# EasyEDA Pro project ProPrj_飞行器设计之5.8Ghz图传_2025-12-20.epro, schematic 5.8Ghz图传_4
Create Date: 2022-09-13; Page Name: P1; Project Name: 飞行器设计之5.8Ghz图传; Schematic Name: 5.8Ghz图传_2; Update Date: 2022-11-13; Company: CYF
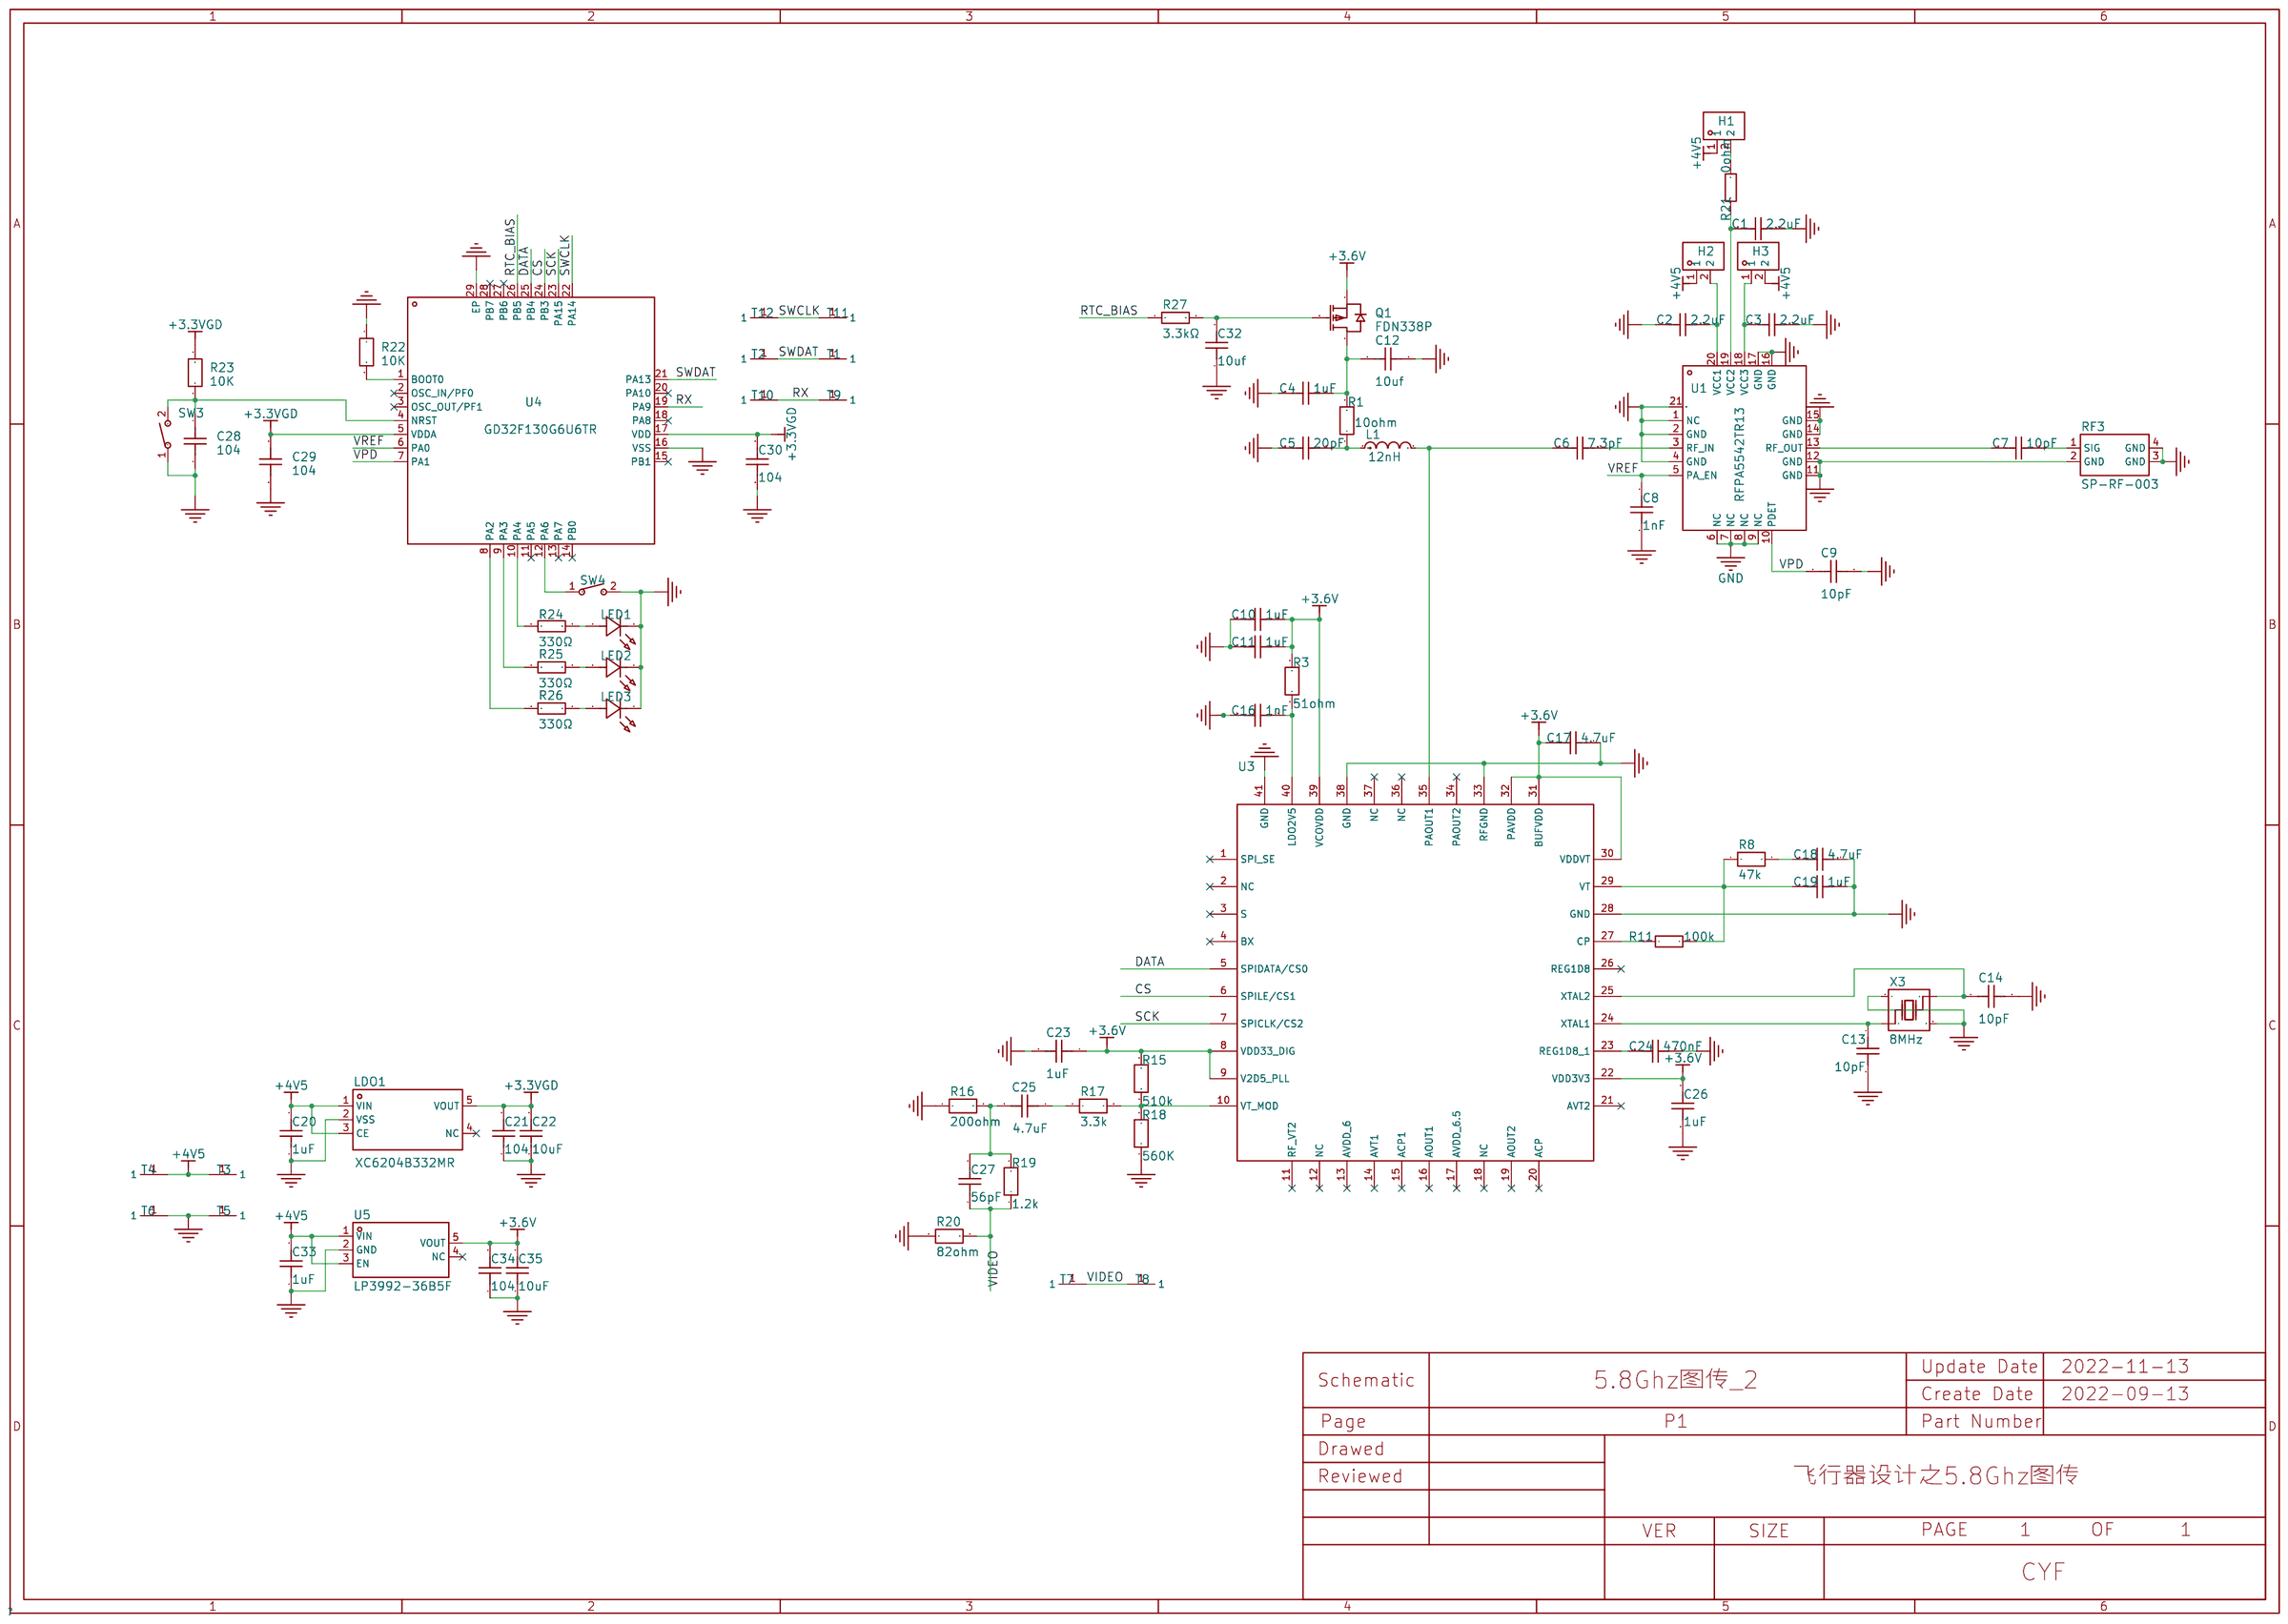
[diagram p3: schematic sheet]

## Parts
C1  2.2uF  [C0402]
C2  2.2uF  [C0402]
C3  2.2uF  [C0402]
C4  1uF  [C0402]
C5  20pF  [C0402-0.5]
C6  7.3pF  [C0201]
C7  10pF  [C0201]
C8  1nF  [C0402]
C9  10pF  [C0402]
C10  1uF  [C0402]
C11  1uF  [C0402]
C12  10uf  [C0402]
C13  10pF  [C0402]
C14  10pF  [C0402]
C16  1nF  [C0402]
C17  4.7uF  [C0402]
C18  4.7uF  [C0402]
C19  1uF  [C0402]
C20  1uF  [C0402]
C21  104  [C0402]
C22  10uF  [C0402]
C23  1uF  [C0402]
C24  470nF  [C0402]
C25  4.7uF  [C0402]
C26  1uF  [C0402]
C27  56pF  [C0402]
C28  104  [C0402]
C29  104  [C0402]
C30  104  [C0402]
C32  10uf  [C0402]
C33  1uF  [C0402]
C34  104  [C0402]
C35  10uF  [C0402]
H1  KH-1.27PH180-1X2P-L7.2  [HDR-TH_2P-P1.27-V-M]
H2  KH-1.27PH180-1X2P-L7.2  [HDR-TH_2P-P1.27-V-M]
H3  KH-1.27PH180-1X2P-L7.2  [HDR-TH_2P-P1.27-V-M]
L1  12nH  [L0201]
LDO1  XC6204B332MR  [SOT-23-5_L3.0-W1.7-P0.95-LS2.8-BR]
LED1  XL-1608UBC-04  [LED0603-RD_BLUE]
LED2  XL-1608UBC-04  [LED0603-RD_BLUE]
LED3  XL-1608UBC-04  [LED0603-RD_BLUE]
Q1  FDN338P  [SOT-23-3_L2.9-W1.3-P1.90-LS2.4-BR]
R1  10ohm  [R0402-0.5]
R3  51ohm  [R0402]
R8  47k  [R0402]
R11  100k  [R0402]
R15  510k  [R0402]
R16  200ohm  [R0402]
R17  3.3k  [R0402]
R18  560K  [R0402]
R19  1.2k  [R0402]
R20  82ohm  [R0402]
R21  0ohm  [R0402]
R22  10K  [R0402]
R23  10K  [R0402]
R24  330Ω  [R0402]
R25  330Ω  [R0402]
R26  330Ω  [R0402]
R27  3.3kΩ  [R0402]
RF3  SP-RF-003  [IPEX-SMD_SP-RF-003]
SW3  TS342A2P-WZ  [SW-SMD_L4.0-W2.9-LS5.0]
SW4  TS342A2P-WZ  [SW-SMD_L4.0-W2.9-LS5.0]
T1  -  [TEST_PAD]
T2  -  [TEST_PAD]
T3  -  [TEST_PAD]
T4  -  [TEST_PAD]
T5  -  [TEST_PAD]
T6  -  [TEST_PAD]
T7  -  [TEST_PAD]
T8  -  [TEST_PAD]
T9  -  [TEST_PAD]
T10  -  [TEST_PAD]
T11  -  [TEST_PAD]
T12  -  [TEST_PAD]
U1  RFPA5542TR13  [QFN-20_L4.0-W4.0]
U3  -  [QFN-40-1]
U4  GD32F130G6U6TR  [QFN-28_L4.0-W4.0-P0.40-BL-EP]
U5  LP3992-36B5F  [SOT-23-5_L3.0-W1.7-P0.95-LS2.8-BL]
X3  8MHz  [OSC-SMD_4P-L3.2-W2.5-BL]

## Library data of the parts
C1-C3 = C1005X7S1A225KT000E: 温度系数:X7S;容值:2.2uF;电容体长:-;精度:±10%;电容体宽:-;电容体厚度:-;额定电压:10V;; LCSC Part Name: 2.2uF(225) ±10% 10V; Supplier Part: C445740; Manufacturer: TDK; Supplier Footprint: 0402; JLCPCB Part Class: Extended Part; Datasheet: https://atta.szlcsc.com/upload/public/pdf/source/20191108/C445740_EC5E1EA4727CB2A1B59729B04E8D3664.pdf; Supplier: LCSC; Temperature Coefficient: X7S; Tolerance: ±10%; Voltage Rated: 10V
C4 C10 C11 C19 C20 C23 C26 C33 = C1005X5R1A105KTJ00F: 容值:1uF;精度:±10%;额定电压:10V;材质(温度系数):X5R;; LCSC Part Name: 1uF ±10% 10V; Supplier Part: C694162; Manufacturer: TDK; Supplier Footprint: 0402; JLCPCB Part Class: Extended Part; Datasheet: https://atta.szlcsc.com/upload/public/pdf/source/20191008/C432930_1569A900251E35B50161EFC1E9A1C511.pdf; Supplier: LCSC; Tolerance: ±10%; Voltage Rated: 10V; Temperature Coefficient: X5R
C5 = CC0201GRNPO9BN200: 温度系数:NP0;精度:±2%;电容体长:-;容值:20pF;电容体宽:-;电容体厚度:-;额定电压:50V;; Supplier: LCSC; Supplier Part: C541253; Supplier Footprint: 0201; JLCPCB Part Class: Extended Part; LCSC Part Name: 20pF ±2% 50V; Tolerance: ±2%; Datasheet: https://atta.szlcsc.com/upload/public/pdf/source/20200615/C541253_9EA6E2C9F1C0B6F889020B56608FD726.pdf; Manufacturer: YAGEO(国巨); Temperature Coefficient: NP0; Voltage Rated: 50V
C6 C7 = GJM0335C1E100FB01D: 容值:10pF;精度:±1%;额定电压:25V;材质(温度系数):C0G;; LCSC Part Name: 10pF ±1% 25V; Supplier Part: C2891570; Manufacturer: muRata(村田); Supplier Footprint: 0201; JLCPCB Part Class: Extended Part; Datasheet: https://atta.szlcsc.com/upload/public/pdf/source/20210910/F9DCB1D557D9855623001B89175B6F09.pdf; Supplier: LCSC; Tolerance: ±1%; Voltage Rated: 25V; Temperature Coefficient: C0G
C8 C16 = C0402C102K5RACAUTO: 温度系数:X7R;容值:1nF;精度:±10%;额定电压:50V;; LCSC Part Name: 1nF(102) ±10% 50V; Supplier Part: C141053; Manufacturer: KEMET(基美); Supplier Footprint: 0402; JLCPCB Part Class: Extended Part; Datasheet: https://atta.szlcsc.com/upload/public/pdf/source/20180326/C141053_0F41C27EF3713F9AA904312754A59387.pdf; Supplier: LCSC; Temperature Coefficient: X7R; Tolerance: ±10%; Voltage Rated: 50V
C9 C13 C14 = GRM1555C1H100FA01D: 容值:10pF;精度:±1%;额定电压:50V;温度系数:C0G;; LCSC Part Name: 10pF ±1% 50V; Supplier Part: C161520; Manufacturer: muRata(村田); Supplier Footprint: 0402; JLCPCB Part Class: Extended Part; Datasheet: https://atta.szlcsc.com/upload/public/pdf/source/20180403/C161520_9A02104BF56AEB009FBC9B33A38C7A93.pdf; Supplier: LCSC; Tolerance: ±1%; Voltage Rated: 50V; Temperature Coefficient: C0G
C12 C32 = 10uf
C17 C18 C25 = C1005X5R1A475KTJ00E: 容值:4.7uF;精度:±10%;额定电压:10V;材质(温度系数):X5R;; LCSC Part Name: 4.7uF ±10% 10V; Supplier Part: C342983; Manufacturer: TDK; Supplier Footprint: 0402; JLCPCB Part Class: Extended Part; Datasheet: https://atta.szlcsc.com/upload/public/pdf/source/20190225/C342983_2978EAEA2EB9BD3D70BC8CD3A599A0C7.pdf; Supplier: LCSC; Tolerance: ±10%; Voltage Rated: 10V; Temperature Coefficient: X5R
C21 C28-C30 C34 = CAP_0402: 容值:100nF;精度:±10%;额定电压:16V;温度系数:X7R;; Supplier Part: C1525; Supplier Footprint: 0402
C22 C35 = GRM155R61A106ME44D: 容值:10uF;精度:±20%;额定电压:10V;材质(温度系数):X5R;; LCSC Part Name: 10uF ±20% 10V; Supplier Part: C77000; Manufacturer: muRata(村田); Supplier Footprint: 0402; JLCPCB Part Class: Extended Part; Datasheet: https://atta.szlcsc.com/upload/public/pdf/source/20180530/C77000_4866797CFE3A842CD03C597EBD6AE6CD.pdf; Supplier: LCSC; Tolerance: ±20%; Voltage Rated: 10V; Temperature Coefficient: X5R
C24 = GRM155C81C474KE01D: 容值:470nF;精度:±10%;额定电压:16V;材质(温度系数):X6S;; LCSC Part Name: 470nF ±10% 16V; Supplier Part: C162162; Manufacturer: muRata(村田); Supplier Footprint: 0402; JLCPCB Part Class: Extended Part; Datasheet: https://atta.szlcsc.com/upload/public/pdf/source/20191226/C162162_83BD8EAA09A667F500D501D4FA61E7F9.pdf; Supplier: LCSC; Tolerance: ±10%; Voltage Rated: 16V; Temperature Coefficient: X6S
C27 = CL05C560JB51PNC: 容值:56pF;精度:±5%;额定电压:50V;材质(温度系数):C0G;; LCSC Part Name: 56pF ±5% 50V; Supplier Part: C472455; Manufacturer: SAMSUNG(三星); Supplier Footprint: 0402; JLCPCB Part Class: Extended Part; Datasheet: https://atta.szlcsc.com/upload/public/pdf/source/20191223/C472455_77C29F1AA91604A0158436A00A53DD86.pdf; Supplier: LCSC; Tolerance: ±5%; Voltage Rated: 50V; Temperature Coefficient: C0G
H1-H3 = KH-1.27PH180-1X2P-L7.2: 间距:1.27mm;总PIN位数:2;排数:1;插针结构:1x2P;行距:-;安装类型:直插;圆针/方针:方针;额定电流:1A;额定电压:-;配合针长度:3.9mm;塑高:1mm;端接针长度:2.3mm;工作温度范围:-40~+105;颜色:-;; LCSC Part Name: 1.27mm 1x2P 直插 方针; Supplier Part: C2938400; Manufacturer: kinghelm(金航标); Supplier Footprint: 插件,P=1.27mm; JLCPCB Part Class: Extended Part; Datasheet: https://atta.szlcsc.com/upload/public/pdf/source/20211228/57F3739EB46B12C24FE81C3BF1D5EF55.pdf; Supplier: LCSC; Pitch: 1.27mm; Number of Pins: 2; Number of Rows: 1; Pin Structure: 1x2P; Mounting Type: 直插; Circluar Pins/Square Pins: 方针; Current Rating (Max): 1A; Length of Mating Pin: 3.9mm; Insulation Height: 1mm; Length of End Connection Pin: 2.3mm; Operating Temperature Range: -40~+105
L1 = LQP03TN3N6B02D: 电感值:3.6nH;精度:±0.1nH;额定电流:-;饱和电流(Isat):-;直流电阻(DCR):300mΩ;; Supplier: LCSC; Supplier Part: C162616; Supplier Footprint: 0201; JLCPCB Part Class: Extended Part; LCSC Part Name: 3.6nH ±0.1nH 300mΩ; Tolerance: ±0.1nH; Datasheet: https://atta.szlcsc.com/upload/public/pdf/source/20180814/C162616_AB57828BE0B922B42F389197093E93C5.pdf; Manufacturer: muRata(村田); DC Resistance (DCR): 300mΩ; Frequency - Self Resonant: 6GHz; Q @ Freq: 14@500MHz
LDO1 = XC6204B332MR: 输出类型:固定;输出极性:正;输出通道数:1;最大输入电压:10V;输出电压:3.3V;压差:330mV@(100mA);输出电流:150mA;电源纹波抑制比(PRSS):70dB@(10kHz);; LCSC Part Name: Vin=10V Vout=3.3V 150mA 70dB@(10kHz); Supplier Part: C80697; Manufacturer: TOREX(特瑞仕); Supplier Footprint: SOT-23-5; JLCPCB Part Class: Extended Part; Datasheet: https://atta.szlcsc.com/upload/public/pdf/source/20160903/1472896601676.pdf; Supplier: LCSC; Output Type: 固定; Output Polarity: 正; Number of Outputs: 1; Maximum Input Voltage: 10V; Output Voltage: 3.3V; Dropout Voltage: 330mV@(100mA); Output Current: 150mA; Power Supply Rejection Ratio (PRSS): 70dB@(10kHz)
LED1-LED3 = XL-1608UBC-04: 发光颜色:蓝灯;透镜颜色:无色透明;主波长:460nm~469nm;峰值波长:475nm;色温:-;光通量(25时):-;测试电流:25mA;正向电压(VF):2.9V;发光强度:60mcd;功率:80mW;发光角度:120°;安装方式:正贴;工作温度:-30~+85;; LCSC Part Name: 蓝灯 正贴; Supplier Part: C965807; Manufacturer: XINGLIGHT(成兴光); Supplier Footprint: 0603; JLCPCB Part Class: Extended Part; Datasheet: https://atta.szlcsc.com/upload/public/pdf/source/20201230/C965807_0B1866580FA037C0283EE42D08A2BF0F.pdf; Supplier: LCSC; Emitted Color: 蓝灯; Lens Color: 无色透明; Dominant Wavelength: 460nm~469nm; Peak Wavelength: 475nm; Forward Current: 25mA; Forward Voltage (VF): 2.9V; Luminous Intensity: 60mcd; Power Dissipation: 80mW; Viewing Angle: 120°; Mounting Sytle: 正贴; Operating Temperature: -30~+85
Q1 = FDN338P_C518789: 漏源电压（Vdss）:20V;连续漏极电流（Id）（25°C 时）:3A;栅源极阈值电压:1V @ 250uA;漏源导通电阻:100mΩ @ 3A,4.5V;最大功率耗散（Ta=25°C）:1W;类型:P沟道;; Supplier Part: C518789; Manufacturer: HUASHUO(华朔); Supplier Footprint: SOT-23-3; JLCPCB Part Class: Extended Part; Datasheet: https://atta.szlcsc.com/upload/public/pdf/source/20200421/C518789_D5DDD5CD134B3D6DE53D66BD1C002E54.pdf; Supplier: LCSC
R1 = ERJ1GNF10R0C: 阻值:10Ω;精度:±1%;功率:50mW;; Power(Watts): 50mW; Supplier: LCSC; Supplier Part: C717005; Supplier Footprint: 0201; JLCPCB Part Class: Extended Part; LCSC Part Name: 10Ω ±1% 50mW; Tolerance: ±1%; Datasheet: https://atta.szlcsc.com/upload/public/pdf/source/20201126/C717005_1D9EDC7DAFC9209451DC5B78B9B54637.pdf; Manufacturer: PANASONIC(松下)
R3 = ERJ2RKF51R0X: 阻值:51Ω;精度:±1%;功率:100mW;温度系数:±100ppm/;最大工作电压:100V;工作温度范围:-55~+155;; LCSC Part Name: 51Ω ±1% 100mW; Supplier Part: C413057; Manufacturer: PANASONIC(松下); Supplier Footprint: 0402; JLCPCB Part Class: Extended Part; Datasheet: https://atta.szlcsc.com/upload/public/pdf/source/20190820/C413057_3C5D27E6BC9C8BDD75D5FF1586C00B52.pdf; Supplier: LCSC; Tolerance: ±1%; Power(Watts): 100mW; Temperature Coefficient: ±100ppm/; Overload Voltage (Max): 100V; Operating Temperature Range: -55~+155
R8 = ERJ2RKF4702X: LCSC Part Name: 47KΩ(4702) ±1%; Supplier Part: C413103; Manufacturer: PANASONIC(松下); Supplier Footprint: 0402; JLCPCB Part Class: Extended Part; Datasheet: https://atta.szlcsc.com/upload/public/pdf/source/20190820/C413103_733665ABBD1E1D82C449C55FBA055B2C.pdf; Supplier: LCSC
R11 = ERJ2RKF1003X: 阻值:100kΩ;精度:±1%;功率:100mW;温度系数:±100ppm/;最大工作电压:-;工作温度范围:-55~+155;; LCSC Part Name: 100kΩ ±1% 100mW 停产; Supplier Part: C192169; Manufacturer: PANASONIC(松下); Supplier Footprint: 0402; JLCPCB Part Class: Extended Part; Datasheet: https://atta.szlcsc.com/upload/public/pdf/source/20180502/C192169_E542DDD390EC9A5A5C2F0F641FE5D413.pdf; Supplier: LCSC; Tolerance: ±1%; Power(Watts): 100mW; Temperature Coefficient: ±100ppm/; Operating Temperature Range: -55~+155
R15 = ERJ2RKF5103X: 阻值:510kΩ;精度:±1%;功率:100mW;温度系数:±100ppm/;最大工作电压:-;工作温度范围:-55~+125;; LCSC Part Name: 510kΩ ±1% 100mW; Supplier Part: C413120; Manufacturer: PANASONIC(松下); Supplier Footprint: 0402; JLCPCB Part Class: Extended Part; Datasheet: https://atta.szlcsc.com/upload/public/pdf/source/20190820/C413120_F6905343057AF4F4B1F95E8F28A368B4.pdf; Supplier: LCSC; Tolerance: ±1%; Power(Watts): 100mW; Temperature Coefficient: ±100ppm/; Operating Temperature Range: -55~+125
R16 = CRCW0402200RFKED: 电阻类型:厚膜电阻;阻值:200Ω;精度:±1%;功率:63mW;温度系数:±100ppm/K;最大工作电压:50V;工作温度范围:-55~+155;; LCSC Part Name: 200Ω ±1% 63mW; Supplier Part: C482094; Manufacturer: VISHAY(威世); Supplier Footprint: 0402; JLCPCB Part Class: Extended Part; Datasheet: https://atta.szlcsc.com/upload/public/pdf/source/20200618/C481956_E25174B008CE8C884BEDD7D4D15E674F.pdf; Supplier: LCSC; Type: 厚膜电阻; Tolerance: ±1%; Power(Watts): 63mW; Temperature Coefficient: ±100ppm/K; Overload Voltage (Max): 50V; Operating Temperature Range: -55~+155
R17 = CRCW04023K30FKED: 最大工作电压:75V;工作温度范围:-55~+155;电阻长:-;精度:±1 %;功率:63mW;电阻直径:-;电阻高:-;电阻宽:-;温度系数:±100ppm/K;阻值:3.3kΩ;电阻类型:-;; LCSC Part Name: 3.3kΩ ±1%; Supplier Part: C482167; Manufacturer: VISHAY(威世); Supplier Footprint: 0402; JLCPCB Part Class: Extended Part; Datasheet: https://atta.szlcsc.com/upload/public/pdf/source/20200618/C481956_E25174B008CE8C884BEDD7D4D15E674F.pdf; Supplier: LCSC; Overload Voltage (Max): 75V; Operating Temperature Range: -55~+155; Tolerance: ±1 %; Power(Watts): 63mW; Temperature Coefficient: ±100ppm/K
R18 = ERJ2RKF5603X: Supplier: LCSC; Supplier Part: C413121; Supplier Footprint: 0402; JLCPCB Part Class: Extended Part; LCSC Part Name: 560KΩ(5603) ±1%; Datasheet: https://atta.szlcsc.com/upload/public/pdf/source/20190820/C413121_708116196E1F90A27E9EFDB3423FC67B.pdf; Manufacturer: PANASONIC(松下)
R19 = CQ02WGF1201TCE: 阻值:1.2kΩ;精度:±1%;功率:62.5mW;温度系数:±100ppm/;; LCSC Part Name: 1.2kΩ ±1% 62.5mW; Supplier Part: C966872; Manufacturer: UNI-ROYAL(厚声); Supplier Footprint: 0402; JLCPCB Part Class: Extended Part; Datasheet: https://atta.szlcsc.com/upload/public/pdf/source/20191220/C473620_6C11B82F3C06B184C34B0BC4B16C3771.pdf; Supplier: LCSC; Tolerance: ±1%; Power(Watts): 62.5mW; Temperature Coefficient: ±100ppm/
R20 = ERJ2RKF82R0X: 阻值:82Ω;精度:±1%;功率:100mW;温度系数:±100ppm/;最大工作电压:-;工作温度范围:-55~+125;; LCSC Part Name: 82Ω ±1%; Supplier Part: C413062; Manufacturer: PANASONIC(松下); Supplier Footprint: 0402; JLCPCB Part Class: Extended Part; Datasheet: https://atta.szlcsc.com/upload/public/pdf/source/20190820/C413062_AFB0A641FB0D2B21716E04467C9EB1B9.pdf; Supplier: LCSC; Tolerance: ±1%; Power(Watts): 100mW; Temperature Coefficient: ±100ppm/; Operating Temperature Range: -55~+125
R21 = RC0402FR-070RL: 温度系数:-;功率:1/16W;精度:±1%;阻值:0Ω;最大工作电压:50V;工作温度范围:-55~+155;; LCSC Part Name: 0Ω ±1%; Supplier Part: C106231; Manufacturer: YAGEO(国巨); Supplier Footprint: 0402; JLCPCB Part Class: Extended Part; Datasheet: https://atta.szlcsc.com/upload/public/pdf/source/20170518/1495085712260.pdf; Supplier: LCSC; Power(Watts): 1/16W; Tolerance: ±1%; Overload Voltage (Max): 50V; Operating Temperature Range: -55~+155
R22 R23 = FRC0402F1002TS: LCSC Part Name: 10KΩ ±1%; Supplier Part: C2906861; Manufacturer: FOJAN(富捷); Supplier Footprint: 0402; JLCPCB Part Class: Extended Part; Datasheet: https://atta.szlcsc.com/upload/public/pdf/source/20211102/08480A48F159CF742D398A1E4DC90941.pdf; Supplier: LCSC
R24-R26 = CR0402FF3300G: 电阻类型:厚膜电阻;阻值:330Ω;精度:±1%;功率:62.5mW;温度系数:±200ppm/;最大工作电压:50V;工作温度范围:-55~+125;; LCSC Part Name: 330Ω ±1% 62.5mW; Supplier Part: C100375; Manufacturer: LIZ(丽智电子); Supplier Footprint: 0402; JLCPCB Part Class: Extended Part; Datasheet: https://atta.szlcsc.com/upload/public/pdf/source/20170408/1491621431662.pdf; Supplier: LCSC; Type: 厚膜电阻; Tolerance: ±1%; Power(Watts): 62.5mW; Temperature Coefficient: ±200ppm/; Overload Voltage (Max): 50V; Operating Temperature Range: -55~+125
R27 = 0402WGF3301TCE: 电阻类型:厚膜电阻;阻值:3.3kΩ;精度:±1%;功率:62.5mW;温度系数:±100ppm/;最大工作电压:50V;工作温度范围:-55~+155;; LCSC Part Name: 3.3kΩ ±1% 62.5mW; Supplier Part: C25890; Manufacturer: UNI-ROYAL(厚声); Supplier Footprint: 0402; JLCPCB Part Class: Basic Part; Datasheet: https://atta.szlcsc.com/upload/public/pdf/source/20200306/C422600_1E6D84923E4A46A82E41ADD87F860B5C.pdf; Supplier: LCSC; Type: 厚膜电阻; Tolerance: ±1%; Power(Watts): 62.5mW; Temperature Coefficient: ±100ppm/; Overload Voltage (Max): 50V; Operating Temperature Range: -55~+155
RF3 = SP-RF-003: 连接器类型:板端;射频系列:IPEX;接口类型:内针;端口数量:1;阻抗:-;频率-最大值:-;样式:-;接口直径:1.4mm;接口长度/高度:0.55mm;工作温度范围:-;; LCSC Part Name: IPEX 内针 3代; Supplier Part: C920233; Manufacturer: XUNPU(讯普); Supplier Footprint: SMD; JLCPCB Part Class: Extended Part; Datasheet: https://atta.szlcsc.com/upload/public/pdf/source/20201225/C920233_44338BF733EA99A9F616220D1D8A6F25.pdf; Supplier: LCSC; Connector Type: 板端; RF Series: IPEX; Interface Type: 内针; Number of Ports: 1; Interface Diameter: 1.4mm; Interface Length/Height: 0.55mm
SW3 SW4 = TS342A2P-WZ: LCSC Part Name: 轻触开关 3*4*2 两脚小龟不带柱 250gf 黑色塑胶按钮; Supplier Part: C557591; Manufacturer: SHOU HAN(首韩); Supplier Footprint: SMD; JLCPCB Part Class: Extended Part; Datasheet: https://atta.szlcsc.com/upload/public/pdf/source/20200519/C557591_B3A5A21584733303F06306F18577DA8B.pdf; Supplier: LCSC
T1-T12 = TEST_PAD
U1 = RFPA5542TR13: 频率范围:-;IP1dB:-;增益:-;噪声系数:-;; Supplier Part: C469030; Manufacturer: Qorvo; Supplier Footprint: QFN_4X4mm; JLCPCB Part Class: Extended Part; Datasheet: https://atta.szlcsc.com/upload/public/pdf/source/20191212/C469030_D6F7318F7C7F55904A4BD83092D9C25F.pdf; Supplier: LCSC
U3 = RTC
U4 = GD32F130G6U6TR: CPU内核:ARM Cortex-M3;CPU最大主频:72MHz;工作电压范围:2.6V~3.6V;内部振荡器:有;外部时钟频率范围:4MHz~32MHz;程序 FLASH容量:32KB;RAM总容量:4KB;EEPROM/数据 FLASH容量:-;GPIO端口数量:23;ADC(单元数/通道数/位数):1@x10ch/12bit;DAC(单元数/通道数/位数):-;(E)PWM(单元数/通道数/位数):1@x16bit;8位Timer数量:-;16位Timer数量:4;32位Timer数量:1;内部比; Supplier Part: C94320; Manufacturer: GigaDevice(兆易创新); Supplier Footprint: QFN-28; JLCPCB Part Class: Extended Part; Datasheet: https://atta.szlcsc.com/upload/public/pdf/source/20180508/C94320_1F50BC9AA004C7DC56FBFADEBEB35FD5.pdf; Supplier: LCSC; CPU Core: ARM Cortex-M3; Maximum Frequency: 72MHz; Supply Voltage Range: 2.6V~3.6V; Internal Oscillator: 有; External Clock Frequency Rang: 4MHz~32MHz; Program FLASH Size: 32KB; RAM Size: 4KB; GPIO Ports Number: 23; ADC (Units/Channels/bits): 1@x10ch/12bit; (E)PWM (Units/Channels/bits): 1@x16bit; 16Bit Timer Number: 4; 32Bit Timer Number: 1; U(S)ART Number: 2; I2C Number: 1; (Q)SPI Number: 1; Peripherals / Functions / Protocol Stacks: 片载温度传感器；DMA；看门狗；LIN总线协议；PWM；除法器；IrDA；乘法器；RTC实时时钟; Operating Temperature Range: -40~+85
U5 = LP3992-36B5F: 输出类型:固定;输出极性:正;输出通道数:1;最大输入电压:6.5V;输出电压:3.6V;压差:-;输出电流:300mA;电源纹波抑制比(PSRR):76dB@(1kHz);; LCSC Part Name: Vin=6.5V Vout=3.6V 300mA 76dB@(1kHz); Supplier Part: C387682; Manufacturer: LOWPOWER(微源半导体); Supplier Footprint: SOT-23-5; JLCPCB Part Class: Extended Part; Datasheet: https://atta.szlcsc.com/upload/public/pdf/source/20190410/C387682_B8B7B9A3936FEC4BA95F8612E4A51AA8.pdf; Supplier: LCSC; Output Type: 固定; Output Polarity: 正; Number of Outputs: 1; Maximum Input Voltage: 6.5V; Output Voltage: 3.6V; Output Current: 300mA; Power Supply Rejection Ratio (PSRR): 76dB@(1kHz)
X3 = TAXM8M4RDBCCT2T: 晶振类型:SMD 谐振器;频率:8MHz;频率公差:±10ppm;频率稳定度:±15ppm;负载电容:10pF;等效串联电阻(ESR):250Ω;工作温度:-;; LCSC Part Name: 8MHz ±10ppm 10pF; Supplier Part: C400090; Manufacturer: TAE(雅晶鑫); Supplier Footprint: SMD3225-4P; JLCPCB Part Class: Extended Part; Datasheet: https://atta.szlcsc.com/upload/public/pdf/source/20190626/C400090_CF95B89E745AFE4EF2E392EF8AC009D6.pdf; Supplier: LCSC; Crystal Type: SMD 谐振器; Frequency Tolerance: ±10ppm; Frequency Stability: ±15ppm; Load Capacitance: 10pF; Equivalent Series Resistance (ESR): 250Ω

## Nets
+3.3VGD: C21.2 C22.2 C29.1 C30.1 LDO1.5(VOUT) R23.1 U4.5(VDDA) U4.17(VDD)
+3.6V: C10.2 C11.2 C17.2 C23.1 C26.1 C34.2 C35.2 Q1.2(S) R3.2 R15.2 U3.8(VDD33_DIG) U3.9(V2D5_PLL) U3.22(VDD3V3) U3.30(VDDVT) U3.31(BUFVDD) U3.32(PAVDD) U3.39(VCOVDD) U5.5(VOUT)
+4V5: C20.2 C33.2 H1.1 H2.1 H3.2 LDO1.1(VIN) LDO1.3(CE) T3.1 T4.1 U5.1(VIN) U5.3(EN)
GND: C1.2 C2.1 C3.2 C4.1 C5.1 C8.2 C9.1 C10.1 C11.1 C12.1 C13.2 C14.2 C16.2 C17.1 C18.1 C19.1 C20.1 C21.1 C22.1 C23.2 C24.2 C26.2 C28.2 C29.2 C30.2 C32.1 C33.1 C34.1 C35.1 LDO1.2(VSS) LED1.1(K) LED2.1(K) LED3.1(K) R16.1 R18.1 R20.1 R22.1 RF3.2(GND) RF3.3(GND) RF3.4(GND) SW3.1 SW4.2 T5.1 T6.1 U1.1(NC) U1.2(GND) U1.4(GND) U1.6(NC) U1.7(NC) U1.8(NC) U1.9(NC) U1.11(GND) U1.12(GND) U1.14(GND) U1.15(GND) U1.16(GND) U1.17(GND) U1.21(PAD) U3.28(GND) U3.33(RFGND) U3.38(GND) U3.41(GND) U4.16(VSS) U4.29(EP) U5.2(GND) X3.2 X3.4
CS: U3.6(SPILE/CS1) U4.24(PB3)
DATA: U3.5(SPIDATA/CS0) U4.25(PB4)
RTC_BIAS: R27.1 U4.26(PB5)
RX: T9.1 T10.1 U4.19(PA9)
SCK: U3.7(SPICLK/CS2) U4.23(PA15)
SWCLK: T11.1 T12.1 U4.22(PA14)
SWDAT: T1.1 T2.1 U4.21(PA13)
VIDEO: C27.1 R19.1 R20.2 T7.1 T8.1
VPD: C9.2 U1.10(PDET) U4.7(PA1)
VREF: C8.1 U1.5(PA_EN) U4.6(PA0)
$1N35430: R15.1 R17.2 R18.2 U3.10(VT_MOD)
$1N35502: C25.1 R17.1
$1N37428: C25.2 C27.2 R16.2 R19.2
$1N43323: R11.1 U3.27(CP)
$1N43978: C18.2 R8.2
$1N44248: C19.2 R8.1 R11.2 U3.29(VT)
$1N44995: C14.1 U3.25(XTAL2) X3.3
$1N45085: C13.1 U3.24(XTAL1) X3.1
$1N52247: C16.1 R3.1 U3.40(LDO2V5)
$1N57648: C5.2 L1.1 R1.1
$1N59286: C6.2 U1.3(RF_IN)
$1N64215: C24.1 U3.23(REG1D8_1)
$1N103981: C7.2 RF3.1(SIG)
$1N115820: C2.2 H2.2 U1.20(VCC1)
$1N117066: C3.1 H3.1 U1.18(VCC3)
$1N140523: C1.1 R21.1 U1.19(VCC2)
$1N148789: C7.1 U1.13(RF_OUT)
$1N149538: C6.1 L1.2 U3.35(PAOUT1)
$1N177069: R22.2 U4.1(BOOT0)
$1N177434: C28.1 R23.2 SW3.2 U4.4(NRST)
$1N188735: R26.1 U4.8(PA2)
$1N188888: R25.1 U4.9(PA3)
$1N189041: R24.1 U4.10(PA4)
$1N189742: SW4.1 U4.12(PA6)
$1N195519: LED2.2(A) R25.2
$1N195672: LED3.2(A) R26.2
$1N195825: LED1.2(A) R24.2
$1N202366: C32.2 Q1.1(G) R27.2
$1N212259: C4.2 C12.2 Q1.3(D) R1.2
$1N216086: H1.2 R21.2

Not connected (* = marked no-connect by the designer): LDO1 4(NC)*; U3 1(SPI_SE)* 2(NC)* 3(S)* 4(BX)* 11(RF_VT2)* 12(NC)* 13(AVDD_6)* 14(AVT1)* 15(ACP1)* 16(AOUT1)* 17(AVDD_6.5)* 18(NC)* 19(AOUT2)* 20(ACP)* 21(AVT2)* 26(REG1D8)* 34(PAOUT2)* 36(NC)* 37(NC)*; U4 2(OSC_IN/PF0)* 3(OSC_OUT/PF1)* 11(PA5)* 13(PA7)* 14(PB0)* 15(PB1)* 18(PA8)* 20(PA10)* 27(PB6)* 28(PB7)*; U5 4(NC)*
